# EAGLE design LB_BIT_i6_DIMMER-v02(rev1) (EAGLE 6.6.0)
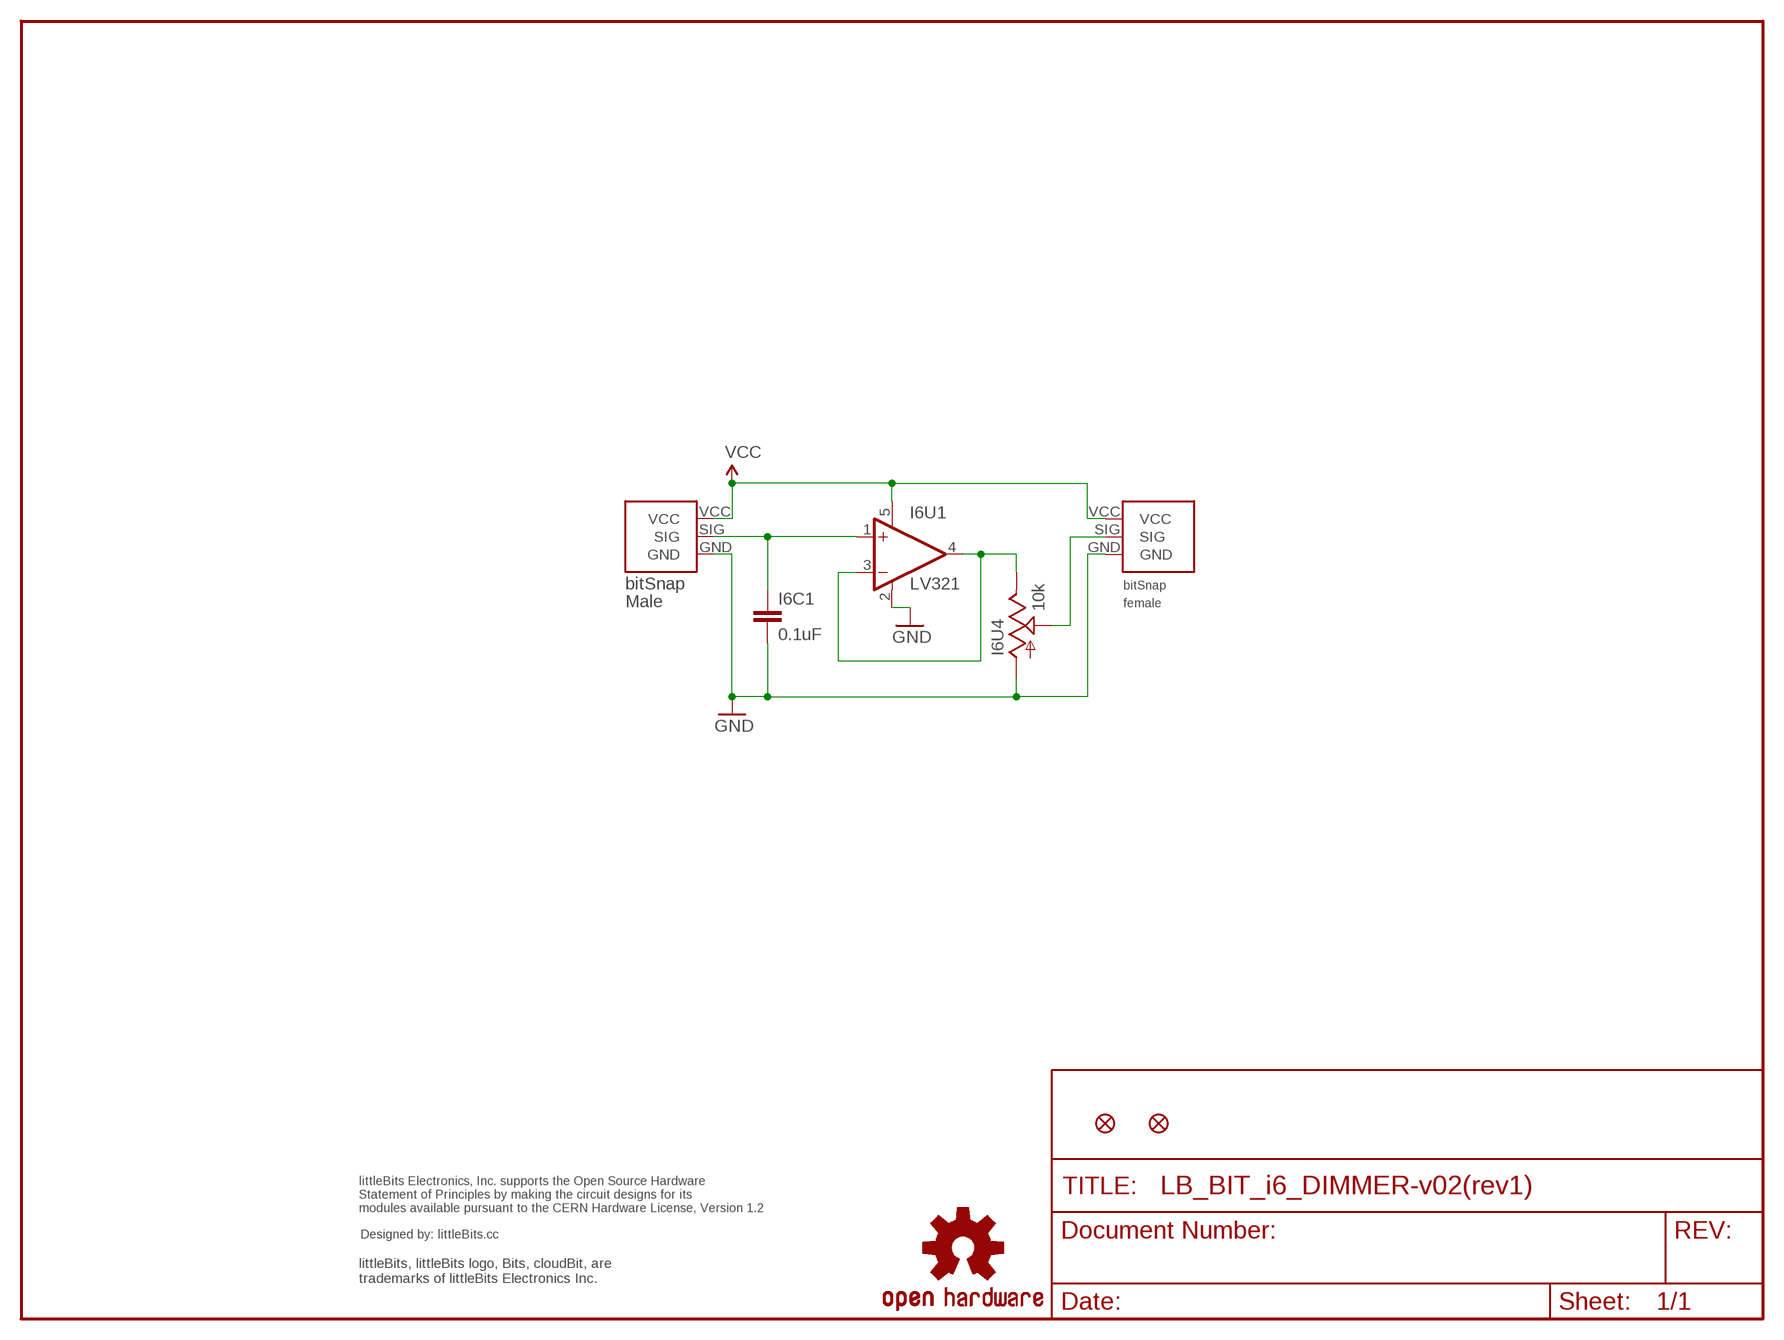
[diagram p0: schematic, sheet 1]

## Parts
I6BSF  BITSNAP_FEMALE  [BITSNAP_FEMALE]
I6BSM  BITSNAP_MALE  [BITSNAP_MALE]
I6C1  0.1uF  CAP0603-CAP  [0603-CAP]
I6U1  LV321  [SC70-5]
I6U4  10k  POT  [ALPS_POT]
JP1  FIDUCIAL1X2.5  [FIDUCIAL-1X2.5]
JP2  FIDUCIAL1X2.5  [FIDUCIAL-1X2.5]
U$1  OSHWCREDIT  [OSHWCREDIT]
U$3  OSHW-LOGOL  [OSHW-LOGO-L]

## Nets
GND: I6BSF.GND I6BSM.GND I6C1.2 I6U1.2(V-) I6U4.P$3(A)
N$1: I6U1.3(-IN) I6U1.4(OUT) I6U4.P$1(E)
POT: I6BSF.SIG I6U4.P$2(S)
SIG: I6BSM.SIG I6C1.1 I6U1.1(+IN)
VCC: I6BSF.VCC I6BSM.VCC I6U1.5(V+)

## Library data of the parts
I6BSF = bitSnap:BITSNAP_FEMALE
I6BSM = bitSnap:BITSNAP_MALE
I6C1 = SparkFun:CAP: Capacitor Standard 0603 ceramic capacitor, and 0.1" leaded capacitor.
I6U1 = LITTLEBITS:LV321
I6U4 = SparkFun:POT
JP1 JP2 = abes:FIDUCIAL: Fiducial Alignment Points Various fiducial points for machine vision alignment.
U$1 = LITTLEBITS:OSHWCREDIT
U$3 = SparkFun:OSHW-LOGO: Open Source Hardware Logo This logo indicates the piece of hardware it is found on incorporates a OSHW license and/or adheres to the definition of open source hardware found here: http://freedomdefined.org/OSHW

## Board
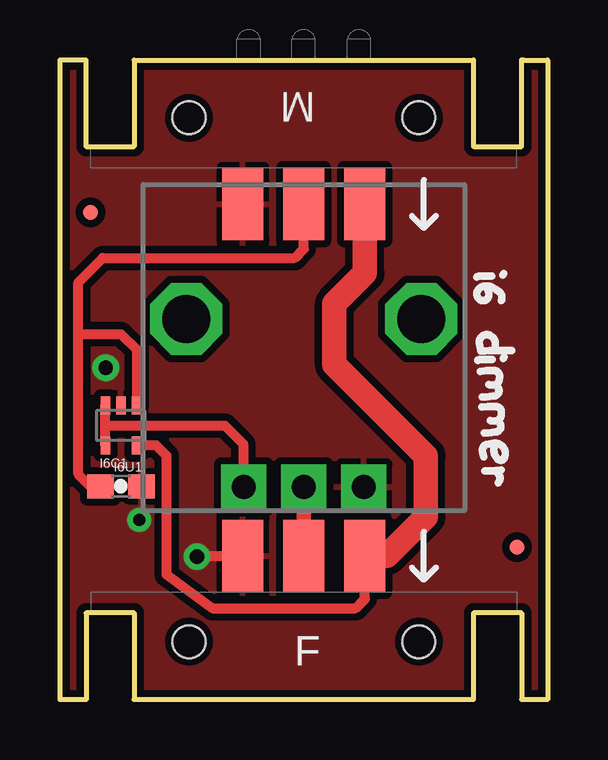
[diagram p1: board, top side]
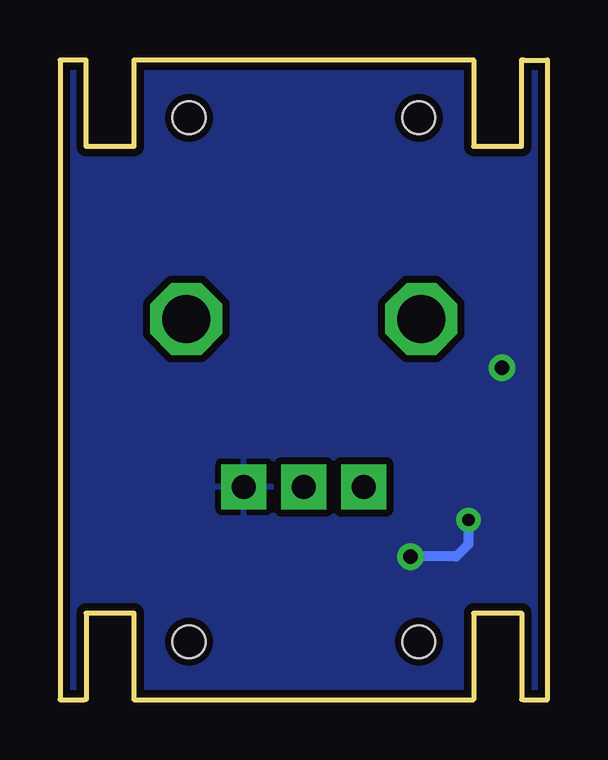
[diagram p2: board, bottom side, seen from below]

Size 20.32 x 26.67 mm. Coordinates in mm from the lower left corner, seen from the top.
Outline: 1.02,26.67 0,26.67 0,0 1.02,0
Outline: 19.3,26.67 20.32,26.67 20.32,0 19.3,0
Copper layers (1*16): Top 0.035mm / dielectric 1.5mm / Bottom 0.035mm
Design rules "default": minimum track width 8mil, minimum drill 20mil, track to track 8mil, track to pad 8mil, pad to pad 8mil, via to via 8mil, smd to smd 8mil, copper to edge 10mil, drill to drill 8mil, minimum pad ring 12mil, minimum via ring 10mil, stop-mask expansion 4mil, vias tented up to drill 25mil, thermal gap 10mil

### Footprints (pad centres in the part's own frame; a part is rotated, then mirrored left to right if it is on the bottom)
BITSNAP_FEMALE = smd 1.7 x 3: GND 6.35,6; SIG 8.89,6; VCC 11.43,6 | hole 1.37: 13.68,2.41; 4.1,2.41
BITSNAP_MALE = smd 1.7 x 3: GND 11.43,6; SIG 8.89,6; VCC 6.35,6 | hole 1.37: 13.68,2.41; 4.1,2.41
0603-CAP = smd 1.1 x 1: 1 -0.85,0; 2 0.85,0
SC70-5 = smd 0.4 x 0.75: 1 -0.65,-0.825; 2 0,-0.825; 3 0.65,-0.825; 4 0.65,0.825; 5 -0.65,0.825
ALPS_POT = drill 1 pad 1.88 square: P$1 7,-2.5; P$2 7,0; P$3 7,2.5 | drill 2 octagon: P$4 0,-4.9; P$5 0,4.9
FIDUCIAL-1X2.5 = smd 0.635 x 0.635: 1 0,0

### Placement (x,y rotation side)
I6BSF  1.27,0 0 top
I6BSM  19.05,26.67 180 top
I6C1  2.54,8.89 0 top
I6U1  2.54,11.43 180 top
I6U4  10.16,15.88 270 top
JP1  19.05,6.35 0 top
JP2  1.27,20.32 0 top
U$1  -19.05,-21.59 0 top  (outside the outline)
U$3  -15.24,-8.89 0 top  (outside the outline)

### Tracks (layer width: path | path; a pad name or v marks a point on that pad's centre or on a via)
GND  (via drill 0.51, 0.6)
  Top 0.406: I6BSF.GND 5.71,6 v5.71,5.97
  Bottom 0.406: v5.71,5.97 3.81,5.97 3.3,6.48 v3.3,7.49
  other vias: 1.91,13.84
  pour Top (isolate 0.305): 0,26.67 0,0 20.32,0 20.32,26.67
  pour Bottom (isolate 0.305): 0,26.67 0,0 20.32,0 20.32,26.67
N$1
  Top 0.406: I6U4.P$1 7.63,10.67 6.87,11.43 1.91,11.43 1.89,11.41 I6U1.4 I6U1.3
POT
  Top 0.61: I6BSF.SIG I6U4.P$2
SIG
  Top 0.305: I6C1.1 1.27,8.89
  Top 0.406: I6BSM.SIG 10.16,18.8 9.78,18.41 1.78,18.41 0.76,17.4 0.76,15.24 | 1.27,8.89 0.76,9.4 0.76,15.24 | I6U1.1 3.19,14.59 2.54,15.24 0.76,15.24
VCC
  Top 0.406: I6BSF.VCC 12.7,4.19 12.32,3.81 6.35,3.81 4.45,5.21 4.45,10.16 4.13,10.48 4,10.61 I6U1.5
  Top 1.016: I6BSM.VCC 12.7,17.78 11.43,16.51 11.43,13.97 15.24,10.16 15.24,7.62 13.62,6 I6BSF.VCC